# EAGLE schematic dpf2_4 (EAGLE 5.10)
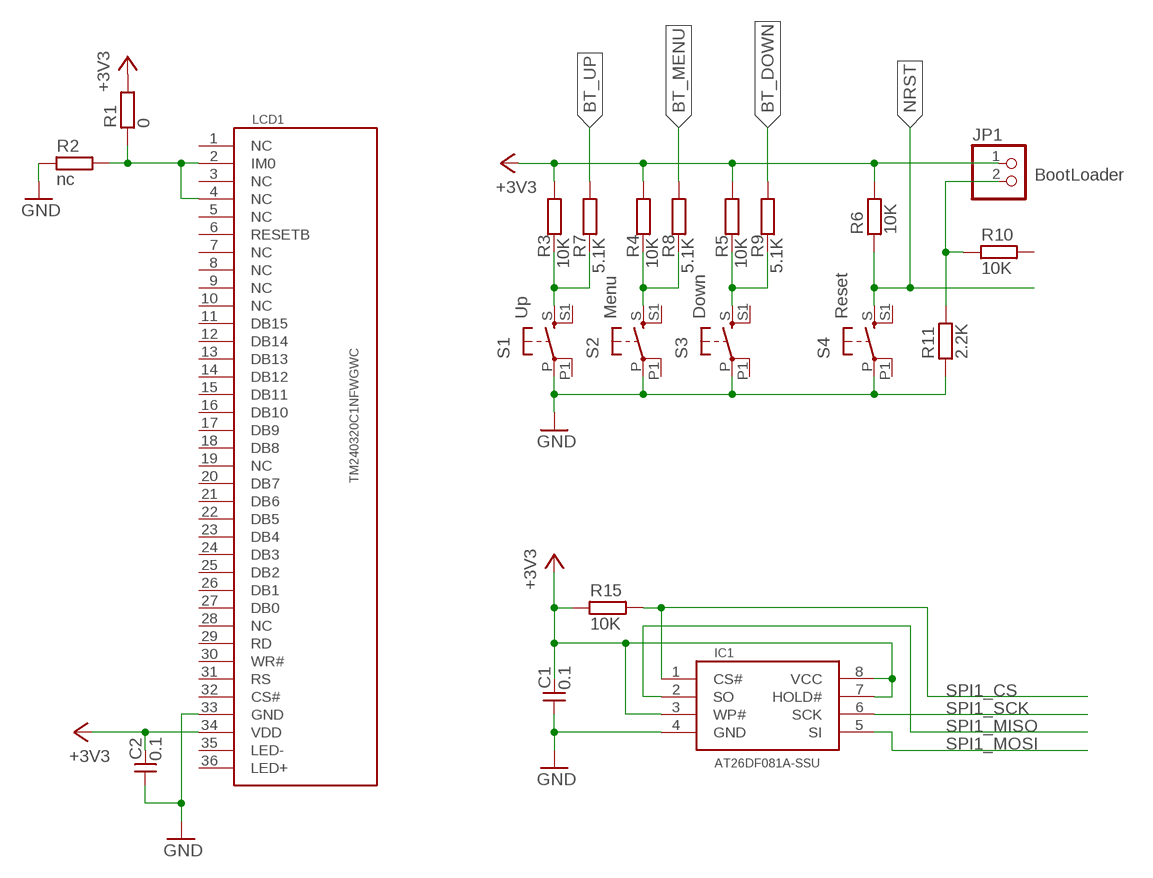
[diagram p0: schematic, sheet 1]

## Parts
C1  0.1  C_0603  [C0603]
C2  0.1  C_0603  [C0603]
IC1  AT26DF081A-SSU  [SO-08]
JP1  PINHD-1X2_2.00  [1X02M]
LCD1  TM240320C1NFWGWC  [TM240320]
R1  0  R_0603  [R0603]
R2  nc  R_0603  [R0603]
R3  10K  R_0603  [R0603]
R4  10K  R_0603  [R0603]
R5  10K  R_0603  [R0603]
R6  10K  R_0603  [R0603]
R7  5.1K  R_0603  [R0603]
R8  5.1K  R_0603  [R0603]
R9  5.1K  R_0603  [R0603]
R10  10K  R_0603  [R0603]
R11  2.2K  R_0603  [R0603]
R15  10K  R_0603  [R0603]
S1  Up  10-XX-4.5  [BT4.5X4.5]
S2  Menu  10-XX-4.5  [BT4.5X4.5]
S3  Down  10-XX-4.5  [BT4.5X4.5]
S4  Reset  10-XX-4.5  [BT4.5X4.5]

## Nets
+3V3: C1.2 C2.2 IC1.3(WP#) IC1.7(HOLD#) IC1.8(VCC) JP1.1 LCD1.34(VDD) R1.2 R3.2 R4.2 R5.2 R6.2 R15.1
BT_DOWN: R9.2
BT_MENU: R8.2
BT_UP: R7.2
GND: C1.1 C2.1 IC1.4(GND) LCD1.33(GND) R2.1 R11.1 S1.P S2.P S3.P S4.P
N$14: LCD1.2(IM0) LCD1.4(NC) R1.1 R2.2
N$15: R3.1 R7.1 S1.S
N$16: R4.1 R8.1 S2.S
N$17: R5.1 R9.1 S3.S
N$19: JP1.2 R10.1 R11.2
NRST: R6.1 S4.S
SPI1_CS: IC1.1(CS#) R15.2
SPI1_MISO: IC1.2(SO)
SPI1_MOSI: IC1.5(SI)
SPI1_SCK: IC1.6(SCK)
Unconnected: LCD1.1(NC) LCD1.3(NC) LCD1.5(NC) LCD1.6(RESETB) LCD1.7(NC) LCD1.8(NC) LCD1.9(NC) LCD1.10(NC) LCD1.11(DB15) LCD1.12(DB14) LCD1.13(DB13) LCD1.14(DB12) LCD1.15(DB11) LCD1.16(DB10) LCD1.17(DB9) LCD1.18(DB8) LCD1.19(NC) LCD1.20(DB7) LCD1.21(DB6) LCD1.22(DB5) LCD1.23(DB4) LCD1.24(DB3) LCD1.25(DB2) LCD1.26(DB1) LCD1.27(DB0) LCD1.28(NC) LCD1.29(RD) LCD1.30(WR#) LCD1.31(RS) LCD1.32(CS#) R10.2 S1.P1 S1.S1 S2.P1 S2.S1 S3.P1 S3.S1 S4.P1 S4.S1

## Notes on the sheet
- BootLoader

## Power pins joined to a net without a drawn wire
LED+: LCD1.36(LED+)
LED-: LCD1.35(LED-)

## Library data of the parts
C1 C2 = rc-master-smd:C_: NON-POLARIZED CAP
IC1 = memory-spi:AT26DF: 8-megabit (1Mbyte) 2.7-volt Only Serial Firmware DataFlash® Memory
JP1 = pinhead-fixdrills:PINHD-1X2: PIN HEADER
LCD1 = lcd:TM240320C1NFWGWC
R1-R11 R15 = rc-master-smd:R_: RESISTOR
S1-S4 = buttons:10-XX: OMRON SWITCH